# EAGLE schematic truth (EAGLE 6.3)
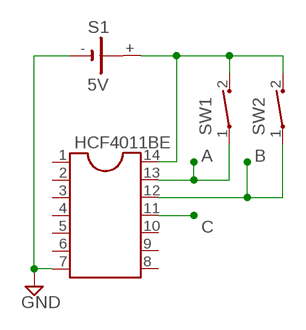
[diagram p0: schematic, sheet 1]

## Parts
HCF4011BE  DIL14  [DIL14]
S1  5V  CRAA  [CRAA]
SW1  CT10-XXXX-G4  [CT10-XXXX-G4]
SW2  CT10-XXXX-G4  [CT10-XXXX-G4]

## Nets
GND: HCF4011BE.7 S1.-
N$1: HCF4011BE.14 S1.+ SW1.2 SW2.2
N$2: HCF4011BE.13 SW1.1
N$3: HCF4011BE.12 SW2.1
N$5: HCF4011BE.11
Unconnected: HCF4011BE.1 HCF4011BE.2 HCF4011BE.3 HCF4011BE.4 HCF4011BE.5 HCF4011BE.6 HCF4011BE.8 HCF4011BE.9 HCF4011BE.10 S1.+@1(+)

## Notes on the sheet
- A | B
- C

## Library data of the parts
HCF4011BE = ic-package:DIL14: Dual In Line / Socket
S1 = battery:CRAA: LI BATTERY Varta
SW1 SW2 = switch-coto:CT10-XXXX-: CT10 Series Molded Switch Source: www.cotorelay.com .. Coto_Technology__CT10-1530-G1.pdf